# EAGLE design NRF24-SHIM (EAGLE 9.6.2)
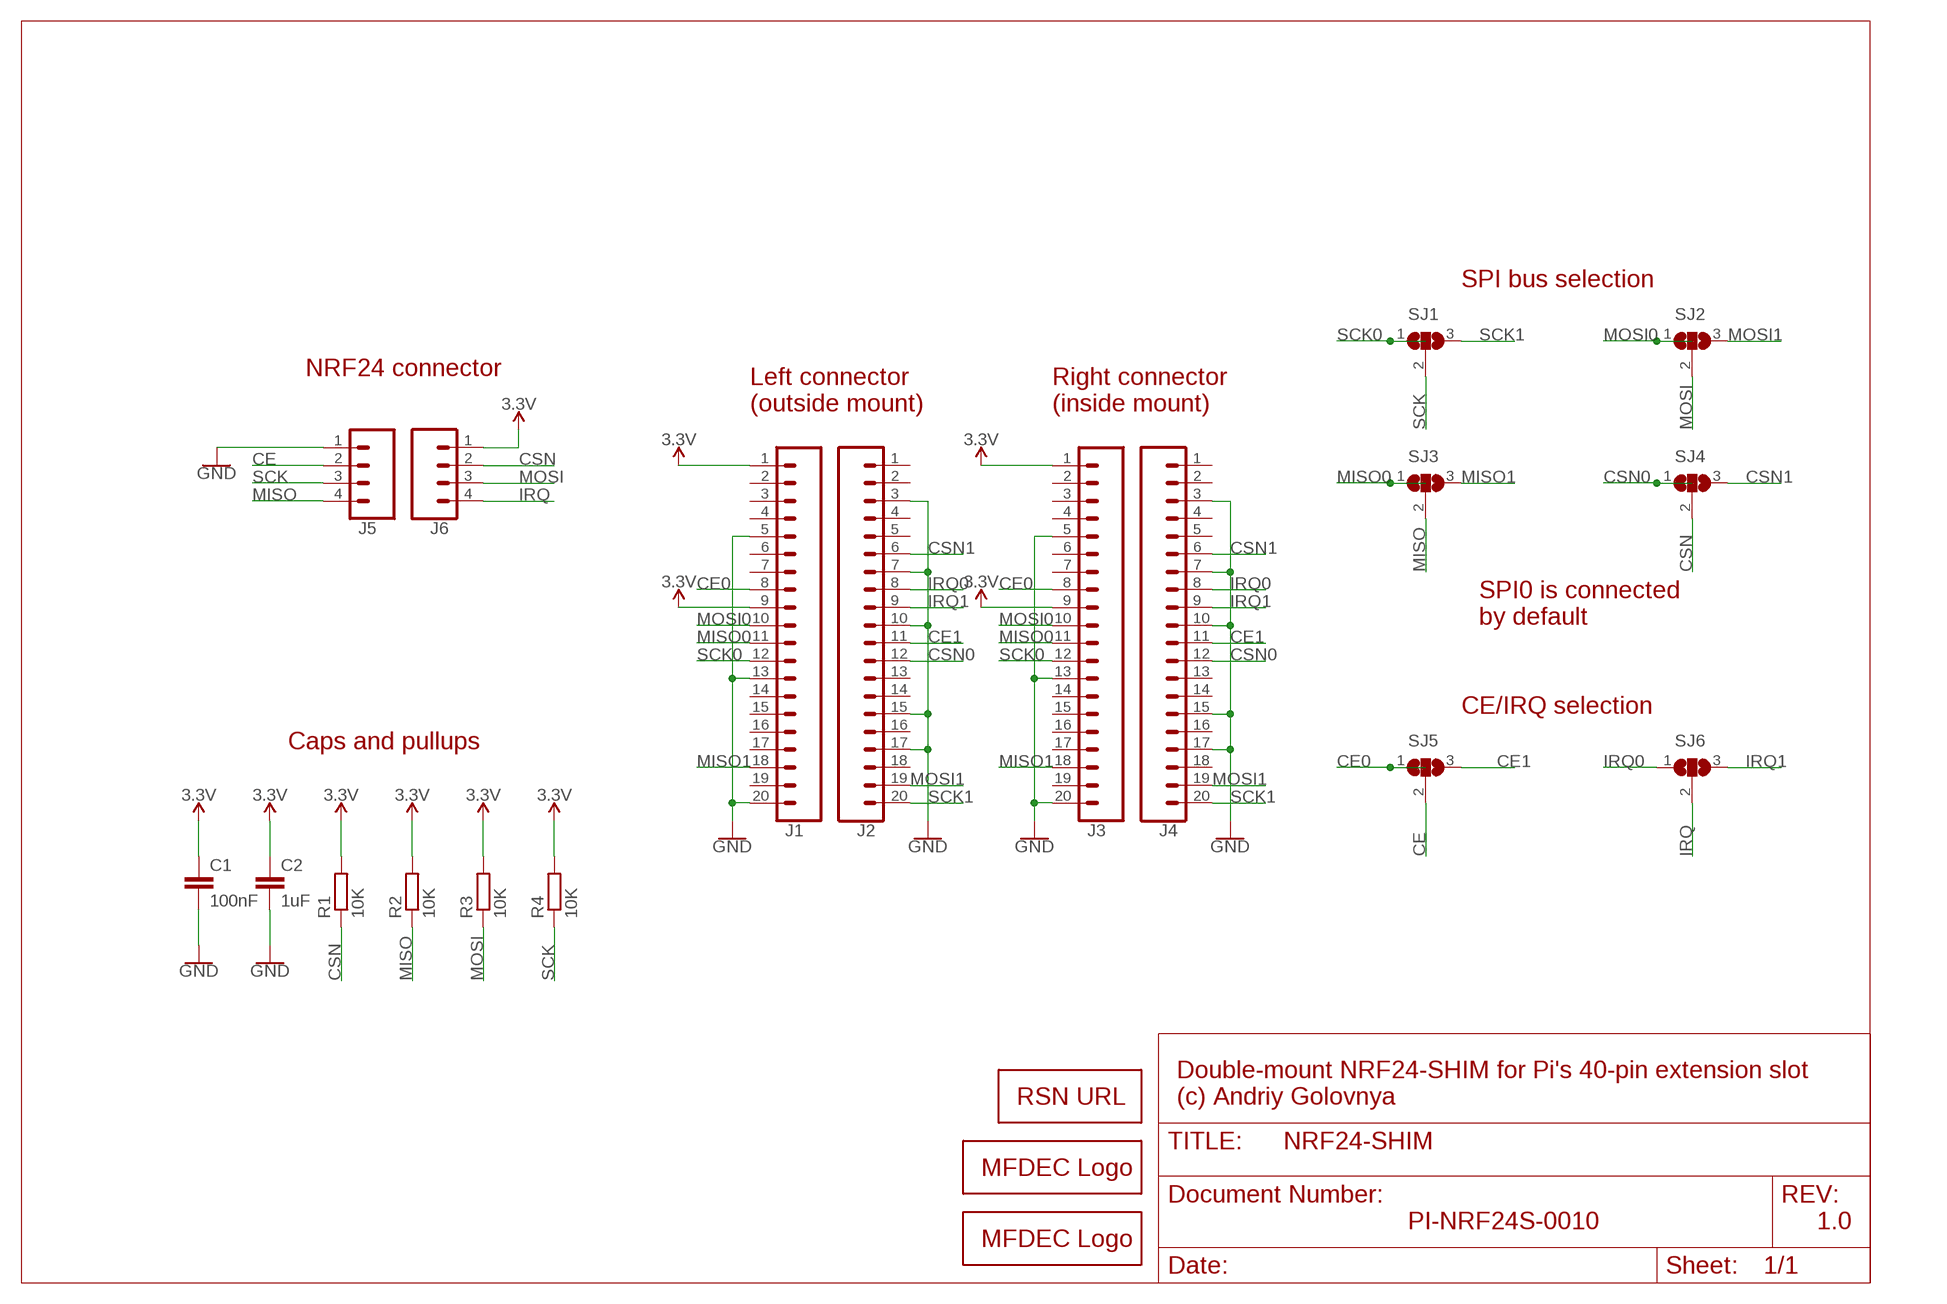
[diagram p0: schematic, sheet 1]

## Parts
C1  100nF  C-EUC0402  [C0402]
C2  1uF  C-EUC0603  [C0603]
J1  CONN_20LOCK  [1X20_LOCK]
J2  CONN_20LOCK  [1X20_LOCK]
J3  CONN_20LOCK  [1X20_LOCK]
J4  CONN_20LOCK  [1X20_LOCK]
J5  CONN_04LOCK  [1X04_LOCK]
J6  CONN_04LOCK  [1X04_LOCK]
LOGO1  MFDECLOGO_SQ_8MM  [MFDEC_SQ_8MM]
LOGO2  MFDECLOGO_L_20MM  [MFDEC_L_20MM]
LOGO3  RSNURL_QR_10MM  [RSNURL_QR_10MM]
R1  10K  R-EU_R0402  [R0402]
R2  10K  R-EU_R0402  [R0402]
R3  10K  R-EU_R0402  [R0402]
R4  10K  R-EU_R0402  [R0402]
SJ1  SJ2  [SJ_2]
SJ2  SJ2  [SJ_2]
SJ3  SJ2  [SJ_2]
SJ4  SJ2  [SJ_2]
SJ5  SJ2  [SJ_2]
SJ6  SJ2  [SJ_2]

## Nets
3.3V: C1.1 C2.1 J1.1 J1.9 J3.1 J3.9 J6.1 R1.2 R2.2 R3.2 R4.2
CE: J5.2 SJ5.2
CE0: J1.8 J3.8 SJ5.1
CE1: J2.11 J4.11 SJ5.3
CSN: J6.2 R1.1 SJ4.2
CSN0: J2.12 J4.12 SJ4.1
CSN1: J2.6 J4.6 SJ4.3
GND: C1.2 C2.2 J1.5 J1.13 J1.20 J2.3 J2.7 J2.10 J2.15 J2.17 J3.5 J3.13 J3.20 J4.3 J4.7 J4.10 J4.15 J4.17 J5.1
IRQ: J6.4 SJ6.2
IRQ0: J2.8 J4.8 SJ6.1
IRQ1: J2.9 J4.9 SJ6.3
MISO: J5.4 R2.1 SJ3.2
MISO0: J1.11 J3.11 SJ3.1
MISO1: J1.18 J3.18 SJ3.3
MOSI: J6.3 R3.1 SJ2.2
MOSI0: J1.10 J3.10 SJ2.1
MOSI1: J2.19 J4.19 SJ2.3
SCK: J5.3 R4.1 SJ1.2
SCK0: J1.12 J3.12 SJ1.1
SCK1: J2.20 J4.20 SJ1.3
Unconnected: J1.2 J1.3 J1.4 J1.6 J1.7 J1.14 J1.15 J1.16 J1.17 J1.19 J2.1 J2.2 J2.4 J2.5 J2.13 J2.14 J2.16 J2.18 J3.2 J3.3 J3.4 J3.6 J3.7 J3.14 J3.15 J3.16 J3.17 J3.19 J4.1 J4.2 J4.4 J4.5 J4.13 J4.14 J4.16 J4.18

## Notes on the sheet
- SPI bus selection
- NRF24 connector
- Left connector
  (outside mount)
- Right connector
  (inside mount)
- SPI0 is connected
  by default
- CE/IRQ selection
- Caps and pullups
- Double-mount NRF24-SHIM for Pi's 40-pin extension slot
  (c) Andriy Golovnya
- PI-NRF24S-0010 | 1.0

## Library data of the parts
C1 C2 = rcl:C-EU: CAPACITOR, European symbol; SPICEPREFIX: C
J1-J4 = _my_locked_connectors:CONN_20: Multi connection point. Often used as Generic Header-pin footprint for 0.1 inch spaced/style header connections On any of the 0.1 inch spaced packages, you can populate with these: Break Away Headers - Straight <https://www.sparkfun.com/products/116> (PRT-00116) Break Away Male Headers - Right Angle <https://www.sparkfun.com/products/553> (PRT-00553) Female Headers <https://www.sparkfun.com/products/115> (PRT-00115) Break Away Headers - Machine Pin <https://www.sparkfun.com/products/117> (PRT-00117) Break Away Female Headers - Swiss Machine Pin <https://www.sparkfun.com/products/743> (PRT-00743) For SCREWTERMINALS and SPRING TERMINALS visit here: Screw Terimnals on SparkFun.com <https://www.sparkfun.com/search/results?term=Screw+Terminals> (5mm/3.5mm/2.54mm spacing) This device is also useful as a general connection point to wire up your design to another part of your project. Our various solder wires solder well into these plated through hole pads. Hook-Up Wire - Assortment (Stranded, 22 AWG) <https://www.sparkfun.com/products/11375> (PRT-11375) Hook-Up Wire - Assortment (Solid Core, 22 AWG) <https://www.sparkfun.com/products/11367> (PRT-11367) View the entire wire category on our website here <https://www.sparkfun.com/categories/141> Special notes: Molex polarized connector foot print use with SKU : PRT-08231 with associated crimp pins and housings. 1MM SMD Version SKU: PRT-10208 NOTES ON THE VARIANTS LOCK and LOCK_LONGPADS... This footprint was designed to help hold the alignment of a through-hole component (i.e. 6-pin header) while soldering it into place. You may notice that each hole has been shifted either up or down by 0.005 of an inch from it's more standard position (which is a perfectly straight line). This slight alteration caused the pins (the squares in the middle) to touch the edges of the holes. Because they are alternating, it causes a "brace" to hold the component in place. 0.005 has proven to be the perfect amount of "off-center" position when using our standard breakaway headers. Although looks a little odd when you look at the bare footprint, once you have a header in there, the alteration is very hard to notice. Also,if you push a header all the way into place, it is covered up entirely on the bottom side. Note about LOCK SPECIAL package: This is just like the LOCK variant in that the holes are staggared by 5 mil, but except for the last two holes. They are not altered from the "standard" footprint layout. This is used for a special purpose on the layout of our Graphic LCD Backpack. Make sure you want to use this device before selecting it for you project!
J5 J6 = _my_locked_connectors:CONN_04: Multi connection point. Often used as Generic Header-pin footprint for 0.1 inch spaced/style header connections On any of the 0.1 inch spaced packages, you can populate with these: Break Away Headers - Straight <https://www.sparkfun.com/products/116> (PRT-00116) Break Away Male Headers - Right Angle <https://www.sparkfun.com/products/553> (PRT-00553) Female Headers <https://www.sparkfun.com/products/115> (PRT-00115) Break Away Headers - Machine Pin <https://www.sparkfun.com/products/117> (PRT-00117) Break Away Female Headers - Swiss Machine Pin <https://www.sparkfun.com/products/743> (PRT-00743) For SCREWTERMINALS and SPRING TERMINALS visit here: Screw Terimnals on SparkFun.com <https://www.sparkfun.com/search/results?term=Screw+Terminals> (5mm/3.5mm/2.54mm spacing) This device is also useful as a general connection point to wire up your design to another part of your project. Our various solder wires solder well into these plated through hole pads. Hook-Up Wire - Assortment (Stranded, 22 AWG) <https://www.sparkfun.com/products/11375> (PRT-11375) Hook-Up Wire - Assortment (Solid Core, 22 AWG) <https://www.sparkfun.com/products/11367> (PRT-11367) View the entire wire category on our website here <https://www.sparkfun.com/categories/141> Special notes: Molex polarized connector foot print use with SKU : PRT-08231 with associated crimp pins and housings. 1MM SMD Version SKU: PRT-10208; PROD_ID: CONN-09696
LOGO1 LOGO2 = _my_logos:MFDECLOGO: Midnight Fog - Digital Eye Candy LOGO
LOGO3 = _my_logos:RSNURL: RedScorp.Net URL
R1-R4 = rcl:R-EU_: RESISTOR, European symbol; SPICEPREFIX: R
SJ1-SJ6 = _my_jumpers:SJ2: SMD solder JUMPER SJ2 - simple jumper SJ2FI - fancy inside jumper SJ2FO - fancy outside jumper SJ2FL - fancy left jumper SJ2FR - fancy right jumper SJ2W - wide jumper

## Board
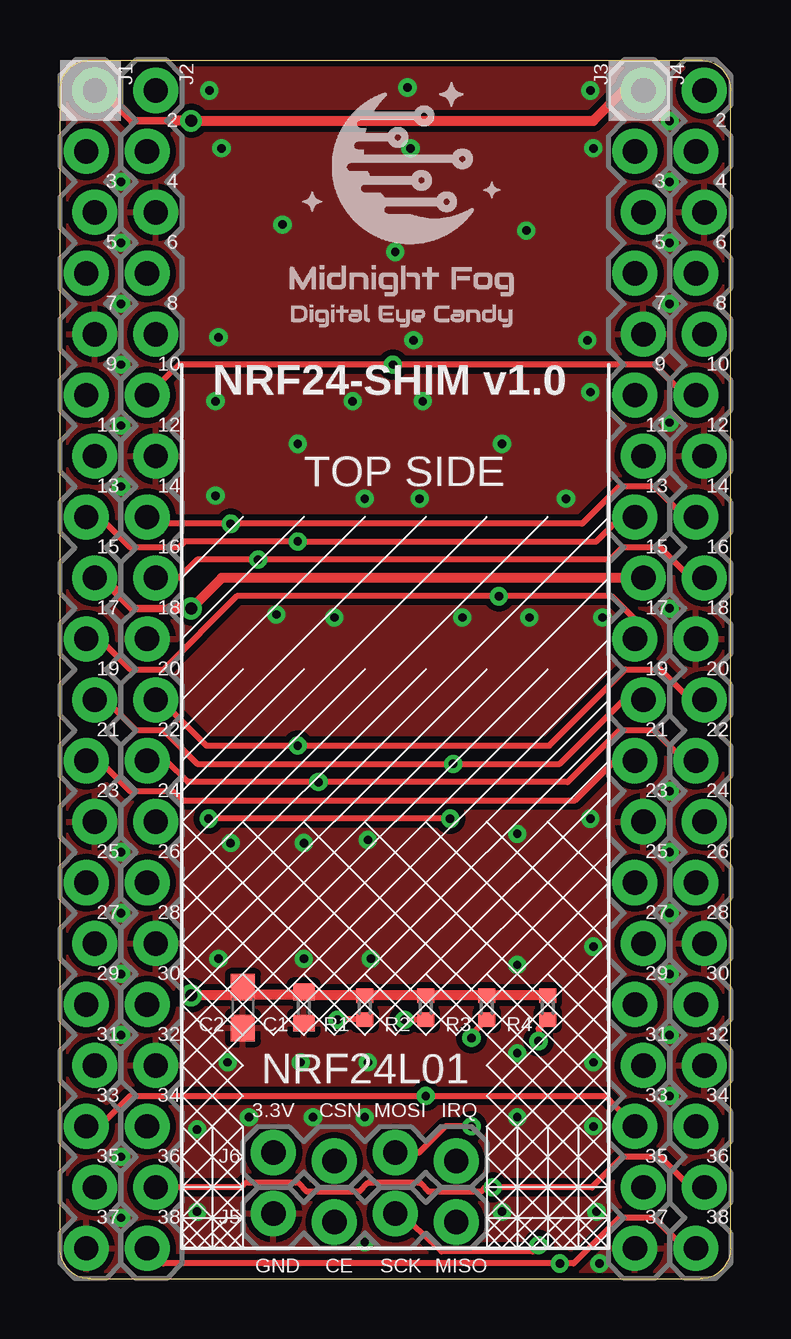
[diagram p1: board, top side]
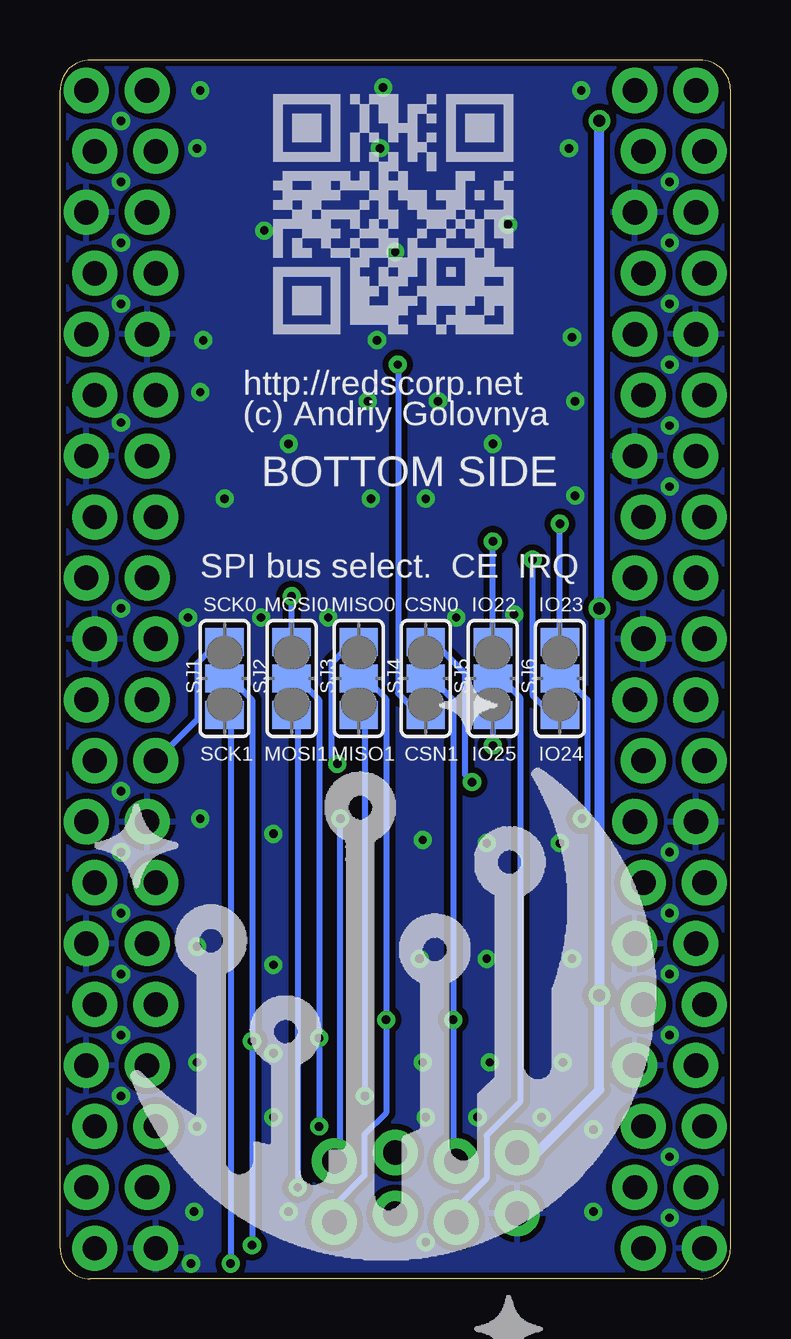
[diagram p2: board, bottom side, seen from below]

Size 27.94 x 50.8 mm. Coordinates in mm from the lower left corner, seen from the top.
Outline: 1.27,0 26.67,0 arc90 27.94,1.27 27.94,49.53 arc90 26.67,50.8 1.27,50.8 arc90 0,49.53 0,1.27 arc90 1.27,0
Copper layers (1*16): Top 0.035mm / dielectric 1.5mm / Bottom 0.035mm
Design rules "default *": minimum track width 6mil, minimum drill 0.35mm, track to track 6mil, track to pad 6mil, pad to pad 6mil, via to via 6mil, smd to smd 6mil, copper to edge 6mil, drill to drill 6mil, minimum pad ring 10mil, minimum via ring 8mil, stop-mask expansion 4mil, vias tented up to drill 20mil, thermal gap 10mil

### Footprints (pad centres in the part's own frame; a part is rotated, then mirrored left to right if it is on the bottom)
C0402 = smd 0.7 x 0.9: 1 -0.65,0; 2 0.65,0
C0603 = smd 1.1 x 1: 1 -0.85,0; 2 0.85,0
1X20_LOCK = drill 1.016 pad 1.88: 1 0,0.178; 2 2.54,-0.178; 3 5.08,0.178; 4 7.62,-0.178; 5 10.16,0.178; 6 12.7,-0.178; 7 15.24,0.178; 8 17.78,-0.178; 9 20.32,0.178; 10 22.86,-0.178; 11 25.4,0.178; 12 27.94,-0.178; 13 30.48,0.178; 14 33.02,-0.178; 15 35.56,0.178; 16 38.1,-0.178; 17 40.64,0.178; 18 43.18,-0.178; 19 45.72,0.178; 20 48.26,-0.178
1X04_LOCK = drill 1.016 pad 1.88: 1 0,0.178; 2 2.54,-0.178; 3 5.08,0.178; 4 7.62,-0.178
R0402 = smd 0.6 x 0.7: 1 -0.5,0; 2 0.5,0
SJ_2 = smd 1.168 x 1.6: 1 -1.524,0; 2 0,0; 3 1.524,0

### Placement (x,y rotation side)
C1  10.16,11.3 270 top
C2  7.62,11.3 270 top
J1  1.27,49.53 270 top
J2  3.81,49.53 270 top
J3  24.13,49.53 270 top
J4  26.67,49.53 270 top
J5  8.89,2.54 0 top
J6  8.89,5.08 0 top
LOGO1  8.89,39.37 0 top
LOGO2  1.27,-5.08 90 bottom  (outside the outline)
LOGO3  19.05,39.37 0 bottom
R1  12.7,11.3 90 top
R2  15.24,11.3 90 top
R3  17.78,11.3 90 top
R4  20.32,11.3 90 top
SJ1  21.08,25.02 270 bottom
SJ2  18.29,25.02 270 bottom
SJ3  15.49,25.02 270 bottom
SJ4  12.7,25.02 270 bottom
SJ5  9.91,25.02 270 bottom
SJ6  7.11,25.02 270 bottom

### Tracks (layer width: path | path; a pad name or v marks a point on that pad's centre or on a via)
3.3V  (via drill 0.5)
  Top 0.305: 4.57,27.94 3.05,27.94 | 4.57,48.26 3.05,48.26
  Top 0.406: J3.1 23.5,49.53 22.23,48.26 v5.46,48.26 4.57,48.26 | J3.9 6.73,29.21 v5.46,27.94 4.57,27.94 | 3.05,48.26 1.78,49.53 J1.1 | 3.05,27.94 1.78,29.21 J1.9 | R4.2 R3.2 R2.2 R1.2 10.31,11.8 C1.1 10.03,11.83 7.95,11.83 C2.1 7.28,11.81 v5.46,11.81
  Bottom 0.406: v5.46,48.26 v5.46,27.94 v5.46,11.81 5.46,7.87 8.08,5.26 J6.1
CE
  Bottom 0.152: SJ5.2 9.91,26.24
  Bottom 0.254: SJ5.2 9.55,25.02 8.76,24.23 8.76,7.37 10.16,5.97 10.16,4.19 11.43,2.92 J5.2
CE0  (via drill 0.35)
  Top 0.254: J1.8 1.65,31.75 2.92,30.48 4.95,30.48 5.21,30.73 v9.91,30.73 22.35,30.73 23.37,31.75 J3.8
  Bottom 0.254: SJ5.1 v9.91,30.73
CE1  (via drill 0.35)
  Top 0.254: J4.11 26.29,24.13 25.02,25.4 23.56,25.4 22.32,24.16 20.39,22.23 v9.91,22.23 6.1,22.23 4.19,24.13 J2.11
  Bottom 0.254: SJ5.3 v9.91,22.23
CSN  (via drill 0.35)
  Top 0.254: R1.1 11.56,10.8 v11.56,10.79
  Bottom 0.152: SJ4.2 12.7,26.24
  Bottom 0.254: SJ4.2 12.45,25.02 11.56,24.13 v11.56,10.79 11.56,5.03 J6.2
CSN0  (via drill 0.35)
  Top 0.254: J4.12 26.04,21.59 24.77,22.86 23.31,22.86 21.15,20.7 v10.77,20.7 5.33,20.7 4.45,21.59 J2.12
  Bottom 0.254: SJ4.1 12.37,26.54 11.05,25.22 11.05,20.98 v10.77,20.7
CSN1  (via drill 0.35)
  Top 0.254: J4.6 26.04,36.83 24.77,38.1 v13.87,38.1 4.95,38.1 J2.6
  Bottom 0.254: v13.87,38.1 13.86,38.09 13.86,24.39 12.96,23.5 SJ4.3
GND  (via drill 0.35)
  other vias: 22.1,49.53 6.22,49.53 14.48,49.66 14.61,47.12 25.4,7.62 25.4,12.7 2.54,40.64 2.54,2.54 2.54,12.7 2.54,10.16 2.54,5.08 25.4,10.16 25.4,15.24 25.4,20.32 25.4,35.69 25.4,40.64 25.4,43.18 25.4,48.26 25.4,45.72 2.54,17.78 2.54,33.02 2.54,35.56 2.54,38.1 25.4,27.94 2.54,15.24 2.54,43.18 2.54,45.72 25.4,17.78 12.83,18.29 10.16,18.16 7.11,18.16 6.99,9.02 10.54,6.73 10.03,9.02 12.83,9.02 19.05,9.4 12.7,6.73 19.05,6.73 22.23,9.02 5.71,2.79 22.35,2.79 18.41,2.79 6.73,47.12 6.6,39.24 21.97,39.12 22.23,47.12 22.1,19.18 19.05,18.54 22.23,6.35 12.7,1.52 5.71,6.22 21.08,32.51 14.99,32.51 12.7,32.51 9.91,34.8 6.48,32.64 22.1,36.96 6.48,36.58 15.11,36.58 12.19,36.58 9.02,27.69 14.73,39.12 13.97,42.8 19.43,43.69 9.27,43.94 6.6,13.34 10.16,13.34 12.95,13.34 19.05,13.08 22.23,13.84 7.87,6.73 11.43,27.56 16.76,27.56 19.56,27.56 22.61,27.56 18.41,34.8 22.48,0.64
  pour Top (isolate 0.254): 0,0 0,50.8 30.61,50.8 30.61,0
  pour Bottom (isolate 0.254): 0,0 0,50.8 33.15,50.8 33.15,0
IRQ  (via drill 0.35)
  Top 0.254: v16.26,19.18 v6.2,19.18
  Bottom 0.254: SJ6.2 6.86,25.02 5.97,24.13 5.97,19.28 6.07,19.18 v6.2,19.18 | v16.26,19.18 16.26,5.16 J6.4
IRQ0  (via drill 0.35)
  Top 0.254: J4.8 26.04,31.75 24.77,33.02 23.31,33.02 21.76,31.47 v7.11,31.47 3.96,31.47 J2.8
  Bottom 0.254: SJ6.1 v7.11,31.47
IRQ1  (via drill 0.35)
  Top 0.254: J4.9 26.29,29.21 25.02,30.48 23.43,30.48 22.93,29.97 v8.26,29.97 5.71,29.97 4.95,29.21 J2.9
  Bottom 0.254: SJ6.3 7.42,23.5 8.26,24.33 v8.26,29.97
MISO  (via drill 0.35)
  Top 0.254: R2.1 v14.35,10.79
  Bottom 0.152: SJ3.2 15.49,26.24
  Bottom 0.254: SJ3.2 15.21,25.02 14.35,24.16 v14.35,10.79 14.35,6.92 15.26,6.02 15.26,4.3 16.51,3.05 J5.4
MISO0  (via drill 0.35)
  Top 0.254: J1.11 1.91,24.13 3.17,22.86 4.32,22.86 5.71,21.46 v16.38,21.46 20.83,21.46 23.5,24.13 J3.11
  Bottom 0.254: SJ3.1 15.75,26.54 16.64,25.65 16.64,21.72 v16.38,21.46
MISO1  (via drill 0.35)
  Top 0.254: J1.18 1.65,6.35 2.92,7.62 v15.24,7.62 22.73,7.62 J3.18
  Bottom 0.254: SJ3.3 15.24,22.99 v15.24,7.62
MOSI  (via drill 0.35)
  Top 0.254: v17.14,6.35 16.04,6.35 14.95,5.26 J6.3 | R3.1 17.14,10.17 v17.14,10.03
  Bottom 0.152: SJ2.2 18.29,26.24
  Bottom 0.254: SJ2.2 18.03,25.02 17.14,24.13 v17.14,10.03 v17.14,6.35
MOSI0  (via drill 0.35)
  Top 0.254: J1.10 1.65,26.67 2.92,25.4 4.32,25.4 7.37,28.45 v18.29,28.45 22.99,28.45 24,27.43 J3.10
  Bottom 0.254: SJ2.1 v18.29,28.45
MOSI1  (via drill 0.35)
  Top 0.254: J4.19 26.29,3.81 25.02,5.08 23.43,5.08 22.16,3.81 v18.03,3.81 17.73,3.81 17.55,3.63 15.36,3.63 15.01,3.99 12.82,3.99 12.47,3.63 10.28,3.63 9.93,3.99 7.72,3.99 7.55,3.81 J2.19
  Bottom 0.254: SJ2.3 18.03,23.11 v18.03,3.81
SCK  (via drill 0.35)
  Top 0.254: v19.94,1.4 19.68,1.14 15.89,1.14 14.23,2.67 14.18,2.72 J5.3 | R4.1 19.94,10.42 v19.94,9.91
  Bottom 0.152: SJ1.2 21.08,26.24
  Bottom 0.254: SJ1.2 20.83,25.02 19.94,24.13 v19.94,9.91 v19.94,1.4
SCK0
  Top 0.254: J1.12 1.65,21.59 2.92,20.32 4.7,20.32 5.08,19.94 21.46,19.94 23.11,21.59 J3.12
  Bottom 0.254: SJ1.1 21.34,26.54 22.23,25.65 22.23,23.32 J3.12
SCK1  (via drill 0.35)
  Top 0.254: J4.20 26.04,1.27 24.77,2.54 23.3,2.54 21.4,0.64 v20.83,0.64 4.32,0.64 J2.20
  Bottom 0.254: SJ1.3 20.83,23.11 v20.83,0.64

### Text on the board
tPlace: 2 | 2 | 3 | 4 | 3 | 4 | 5 | 6 | 5 | 6 | 7 | 8 | 7 | 8 | 9 | 10 | 9 | 10 | NRF24-SHIM v1.0 | 11 | 12 | 11 | 12 | 13 | 14 | TOP SIDE | 13 | 14 | 15 | 16 | 15 | 16 | 17 | 18 | 17 | 18 | 19 | 20 | 19 | 20 | 21 | 22 | 21 | 22 | 23 | 24 | 23 | 24 | 25 | 26 | 25 | 26 | 27 | 28 | 27 | 28 | 29 | 30 | 29 | 30 | 31 | 32 | 31 | 32 | NRF24L01 | 33 | 34 | 3.3V | CSN | MOSI | IRQ | 33 | 34 | 35 | 36 | 35 | 36 | 37 | 38 | 37 | 38 | GND | CE | SCK | MISO
bPlace: http://redscorp.net | (c) Andriy Golovnya | BOTTOM SIDE | SPI bus select. CE IRQ | IO23 | IO22 | CSN0 | MISO0 | MOSI0 | SCK0 | IO24 | IO25 | CSN1 | MISO1 | MOSI1 | SCK1